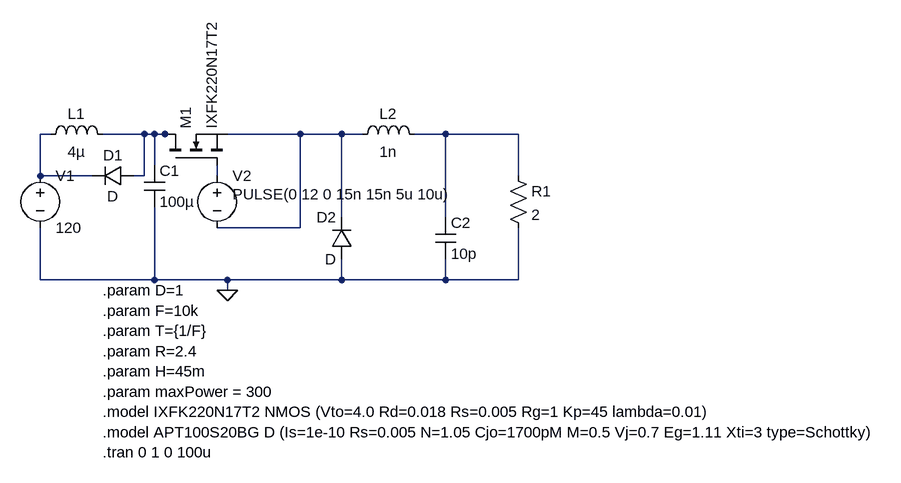
[diagram p0: schematic MOSFET_switch.asc]
MOSFET_switch.asc, the LTspice schematic file:
Version 4
SHEET 1 1892 680
WIRE -496 64 -512 64
WIRE -352 64 -416 64
WIRE -336 64 -352 64
WIRE -320 64 -336 64
WIRE -304 64 -320 64
WIRE -112 64 -224 64
WIRE -48 64 -112 64
WIRE -16 64 -48 64
WIRE 112 64 64 64
WIRE 224 64 112 64
WIRE -336 112 -336 64
WIRE -512 128 -512 64
WIRE -432 128 -512 128
WIRE -352 128 -352 64
WIRE -352 128 -368 128
WIRE -240 128 -240 112
WIRE 224 128 224 64
WIRE -48 192 -48 64
WIRE 112 192 112 64
WIRE -112 208 -112 64
WIRE -112 208 -240 208
WIRE -512 288 -512 208
WIRE -336 288 -336 176
WIRE -336 288 -512 288
WIRE -224 288 -336 288
WIRE -48 288 -48 256
WIRE -48 288 -224 288
WIRE 112 288 112 256
WIRE 112 288 -48 288
WIRE 224 288 224 208
WIRE 224 288 112 288
WIRE -224 304 -224 288
FLAG -224 304 0
SYMBOL voltage -512 112 R0
WINDOW 123 0 0 Left 0
WINDOW 39 0 0 Left 0
SYMATTR InstName V1
SYMATTR Value 120
SYMBOL voltage -240 112 R0
WINDOW 123 0 0 Left 0
WINDOW 39 0 0 Left 0
WINDOW 3 24 44 Left 2
SYMATTR Value PULSE(0 12 0 15n 15n 5u 10u)
SYMATTR InstName V2
SYMBOL nmos -320 112 R270
SYMATTR InstName M1
SYMATTR Value IXFK220N17T2
SYMBOL res 208 112 R0
SYMATTR InstName R1
SYMATTR Value 2
SYMBOL ind -512 80 R270
WINDOW 0 32 56 VTop 2
WINDOW 3 5 56 VBottom 2
SYMATTR InstName L1
SYMATTR Value 4µ
SYMATTR SpiceLine Rser=6m
SYMBOL diode -368 112 R90
WINDOW 0 0 32 VBottom 2
WINDOW 3 32 32 VTop 2
SYMATTR InstName D1
SYMBOL cap -352 112 R0
SYMATTR InstName C1
SYMATTR Value 100µ
SYMATTR SpiceLine Rser=2m
SYMBOL ind -32 80 R270
WINDOW 0 32 56 VTop 2
WINDOW 3 5 56 VBottom 2
SYMATTR InstName L2
SYMATTR Value 1n
SYMBOL cap 96 192 R0
SYMATTR InstName C2
SYMATTR Value 10p
SYMBOL diode -32 256 R180
WINDOW 0 24 64 Left 2
WINDOW 3 24 0 Left 2
SYMATTR InstName D2
TEXT -416 304 Left 2 !.param D=1\n.param F=10k\n.param T={1/F}\n.param R=2.4\n.param H=45m\n.param maxPower = 300\n.model IXFK220N17T2 NMOS (Vto=4.0 Rd=0.018 Rs=0.005 Rg=1 Kp=45 lambda=0.01)\n.model APT100S20BG D (Is=1e-10 Rs=0.005 N=1.05 Cjo=1700pM M=0.5 Vj=0.7 Eg=1.11 Xti=3 type=Schottky)\n.tran 0 1 0 100u

The netlist it stands for:
* MOSFET_switch.asc
V1 N001 0 120
V2 N005 N003 PULSE(0 12 0 15n 15n 5u 10u)
M1 N002 N005 N003 N003 IXFK220N17T2
R1 N004 0 2
L1 N001 N002 4µ Rser=6m
D1 N002 N001 D
C1 N002 0 100µ Rser=2m
L2 N003 N004 1n
C2 N004 0 10p
D2 0 N003 D
.model D D
.lib standard.dio
.model NMOS NMOS
.model PMOS PMOS
.lib standard.mos
.param D=1
.param F=10k
.param T={1/F}
.param R=2.4
.param H=45m
.param maxPower = 300
.model IXFK220N17T2 NMOS (Vto=4.0 Rd=0.018 Rs=0.005 Rg=1 Kp=45 lambda=0.01)
.model APT100S20BG D (Is=1e-10 Rs=0.005 N=1.05 Cjo=1700pM M=0.5 Vj=0.7 Eg=1.11 Xti=3 type=Schottky)
.tran 0 1 0 100u
.backanno
.end